# Altium schematic sheet UTHP BeagleBone Headers.SchDoc: Ultimate Truck Hacking Platform
size Letter; Author: Dr. Jeremy Daily; Organization: Systems Cyber Research Group; Address2: Thomas Balzer; Address3: Carson Green; DocumentNumber: Beagle Bone Black Headers; Revision: 1; SheetNumber: 1; SheetTotal: 6; ENG_APP_DATE: --/--/--; DSN_APP_DATE: --/--/--; CHK_APP_DATE: --/--/--
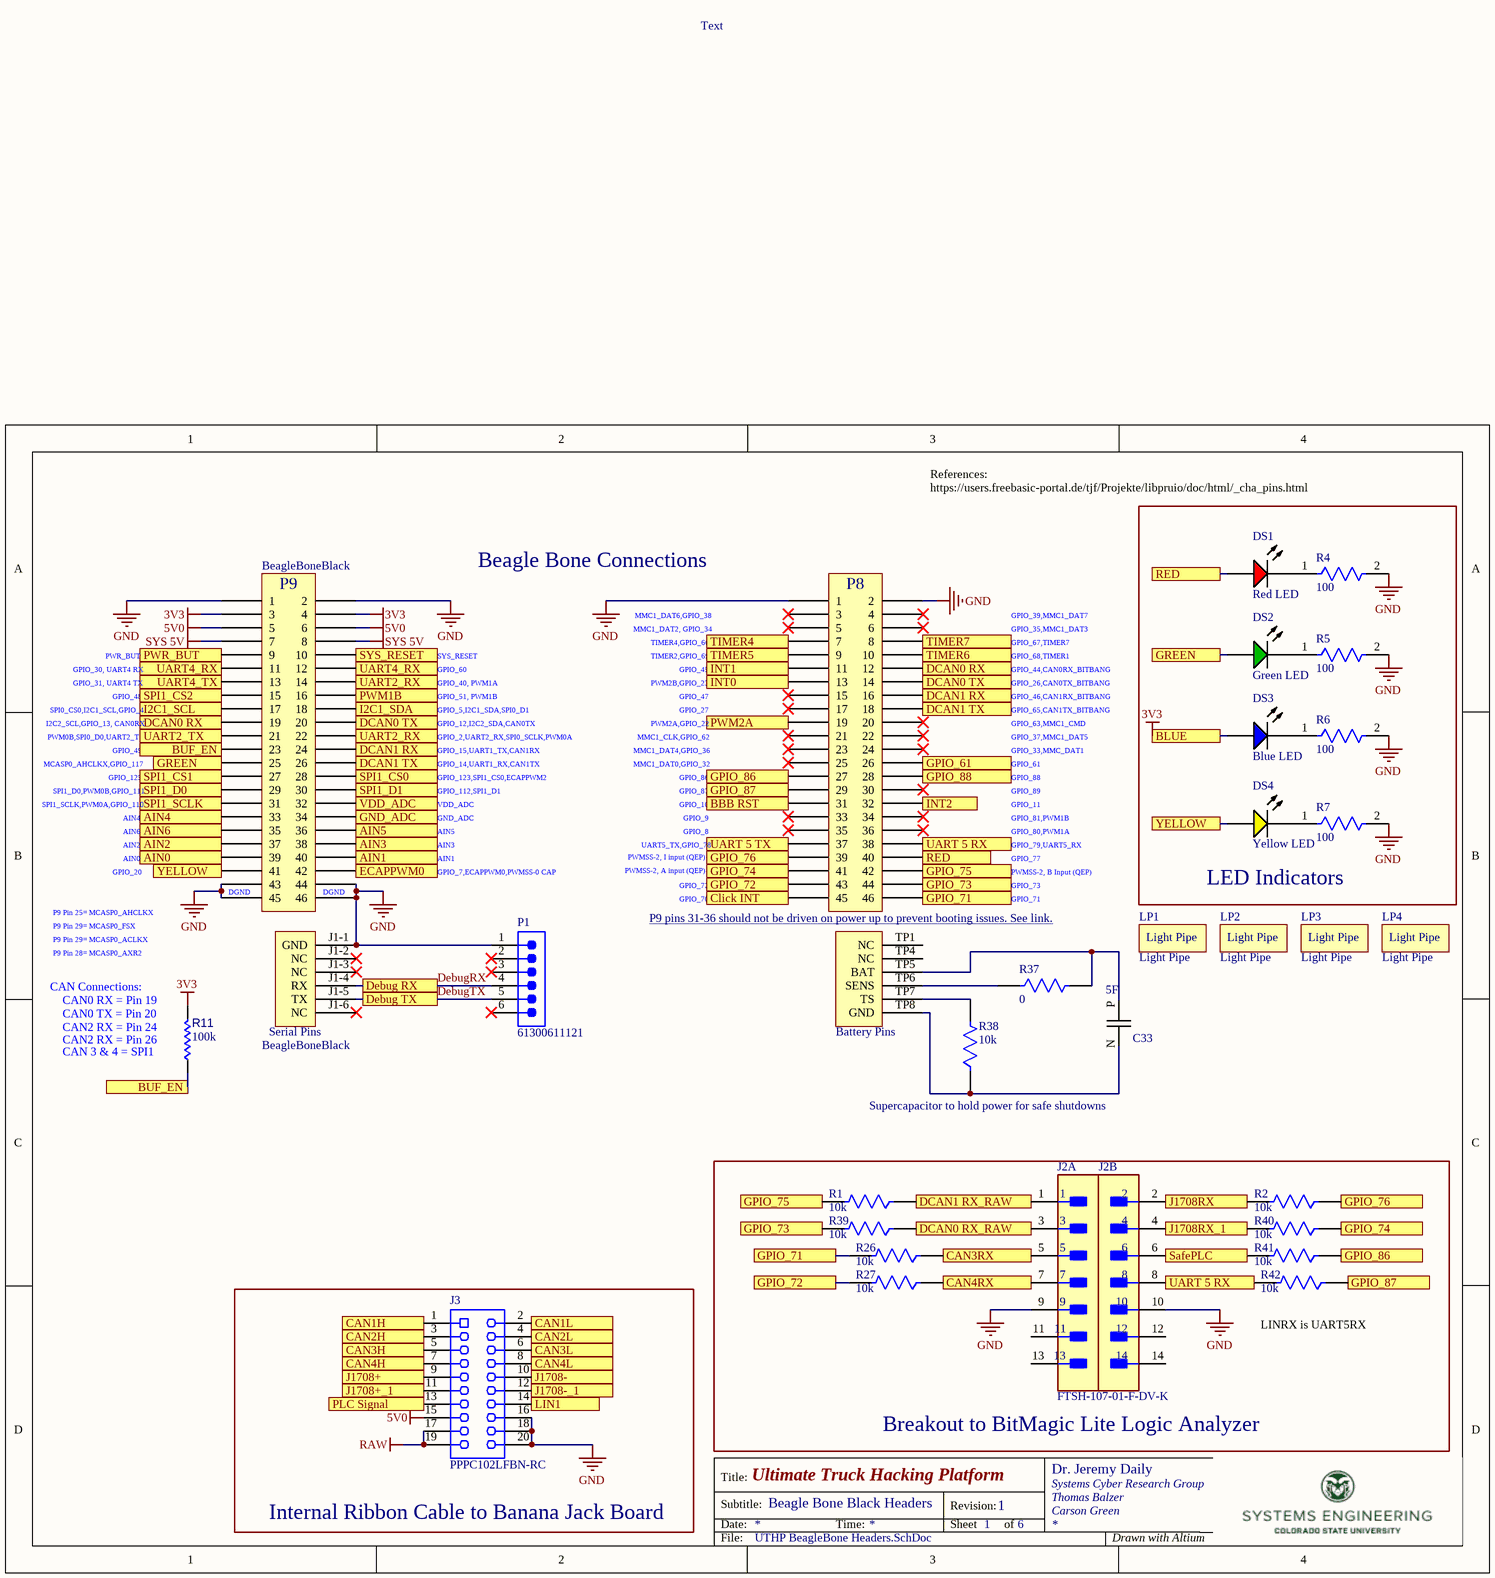
[diagram p0: UTHP BeagleBone Headers.SchDoc]

## Parts
BeagleBoneBlack  BeagleBoneBlack  [Beagleboneblack]
C33  5F  [New footprint 1]
DS1  Red LED  [LTST-C191KRKT_V]
DS2  Green LED  [LTST-C190GKT_V]
DS3  Blue LED  [LTST-C190TBKT-2_V]
DS4  Yellow LED  [LTST-C190KSKT_V]
J2  FTSH-107-01-F-DV-K  [FP-FTSH-107-01-F-DV-K-MFG]  (parts A,B of 2)
J3  PPPC102LFBN-RC  [SLIN-PPPC102LFBN-RC_V]
LP1  Light Pipe  [Lightpipe - SLP3]
LP2  Light Pipe  [Lightpipe - SLP3]
LP3  Light Pipe  [Lightpipe - SLP3]
LP4  Light Pipe  [Lightpipe - SLP3]
P1  61300611121  [61300611121]
R1  10k  [FP-KTR03-IPC_B]
R2  10k  [FP-KTR03-IPC_B]
R4  100  [FP-CRGCQ0603-IPC_C]
R5  100  [FP-CRGCQ0603-IPC_C]
R6  100  [FP-CRGCQ0603-IPC_C]
R7  100  [FP-CRGCQ0603-IPC_C]
R11  value 100k  [RESC1608X55X25ML10T15]  (hidden comment: Resistor 100k +/-1% 0603 100 mW)
R26  10k  [FP-KTR03-IPC_B]
R27  10k  [FP-KTR03-IPC_B]
R37  0  [FP-RMCF0805-MFG]
R38  10k  [FP-KTR03-IPC_B]
R39  10k  [FP-KTR03-IPC_B]
R40  10k  [FP-KTR03-IPC_B]
R41  10k  [FP-KTR03-IPC_B]
R42  10k  [FP-KTR03-IPC_B]

## Blocks framed on the sheet
LED Indicators: DS1-DS4 R4-R7
Breakout to BitMagic Lite Logic Analyzer: J2 R1 R2 R26 R27 R39-R42
Internal Ribbon Cable to Banana Jack Board: J3

## Ports
AIN0, AIN1, AIN2, AIN3, AIN4, AIN5, AIN6, BBB RST, BLUE, BUF_EN, CAN1H, CAN1L, CAN2H, CAN2L, CAN3H, CAN3L, CAN3RX, CAN4H, CAN4L, CAN4RX, Click INT, DCAN0 RX, DCAN0 RX_RAW, DCAN0 TX, DCAN1 RX, DCAN1 RX_RAW, DCAN1 TX, Debug RX, Debug TX, ECAPPWM0, GND_ADC, GPIO_61, GPIO_71, GPIO_72, GPIO_73, GPIO_74, GPIO_75, GPIO_76, GPIO_86, GPIO_87, GPIO_88, GREEN, I2C1_SCL, I2C1_SDA, INT0, INT1, INT2, J1708+, J1708+_1, J1708-, J1708-_1, J1708RX, J1708RX_1, LIN1, PLC Signal, PWM1B, PWM2A, PWR_BUT, RED, SafePLC, SPI1_CS0, SPI1_CS1, SPI1_CS2, SPI1_D0, SPI1_D1, SPI1_SCLK, SYS_RESET, TIMER4, TIMER5, TIMER6, TIMER7, UART2_RX, UART2_TX, UART4_RX, UART4_TX, UART 5 RX, UART 5 TX, VDD_ADC, YELLOW

## Nets
3V3: BeagleBoneBlack.3 BeagleBoneBlack.4 DS3.1(A) R11.2 ; port BLUE
5V0: BeagleBoneBlack.5 BeagleBoneBlack.6 J3.15
GND: BeagleBoneBlack.1 BeagleBoneBlack.2 BeagleBoneBlack.43 BeagleBoneBlack.44 BeagleBoneBlack.45 BeagleBoneBlack.46 BeagleBoneBlack.J1-1(GND) BeagleBoneBlack.P1(1) BeagleBoneBlack.P2(2) J2.9 J2.10 J3.16 J3.18 J3.20 P1.1 R4.2 R5.2 R6.2 R7.2
RAW: J3.17 J3.19
SYS 5V: BeagleBoneBlack.7 BeagleBoneBlack.8
AIN0: BeagleBoneBlack.39 ; port AIN0
AIN1: BeagleBoneBlack.40 ; port AIN1
AIN2: BeagleBoneBlack.37 ; port AIN2
AIN3: BeagleBoneBlack.38 ; port AIN3
AIN4: BeagleBoneBlack.33 ; port AIN4
AIN5: BeagleBoneBlack.36 ; port AIN5
AIN6: BeagleBoneBlack.35 ; port AIN6
BBB RST: BeagleBoneBlack.P31(31) ; port BBB RST
BUF_EN: BeagleBoneBlack.23 R11.1 ; port BUF_EN
CAN1H: J3.1 ; port CAN1H
CAN1L: J3.2 ; port CAN1L
CAN2H: J3.3 ; port CAN2H
CAN2L: J3.4 ; port CAN2L
CAN3H: J3.5 ; port CAN3H
CAN3L: J3.6 ; port CAN3L
CAN3RX: J2.5 R26.1 ; port CAN3RX
CAN4H: J3.7 ; port CAN4H
CAN4L: J3.8 ; port CAN4L
CAN4RX: J2.7 R27.1 ; port CAN4RX
Click INT: BeagleBoneBlack.P45(45) ; port Click INT
DCAN0 RX: BeagleBoneBlack.19 BeagleBoneBlack.P12(12) ; port DCAN0 RX
DCAN0 RX_RAW: J2.3 R39.1 ; port DCAN0 RX_RAW
DCAN0 TX: BeagleBoneBlack.20 BeagleBoneBlack.P14(14) ; port DCAN0 TX
DCAN1 RX: BeagleBoneBlack.24 BeagleBoneBlack.P16(16) ; port DCAN1 RX
DCAN1 RX_RAW: J2.1 R1.1 ; port DCAN1 RX_RAW
DCAN1 TX: BeagleBoneBlack.26 BeagleBoneBlack.P18(18) ; port DCAN1 TX
DebugRX: BeagleBoneBlack.J1-4(RX) P1.4 ; port Debug RX
DebugTX: BeagleBoneBlack.J1-5(TX) P1.5 ; port Debug TX
ECAPPWM0: BeagleBoneBlack.42 ; port ECAPPWM0
GND_ADC: BeagleBoneBlack.34 ; port GND_ADC
GPIO_61: BeagleBoneBlack.P26(26) ; port GPIO_61
GPIO_71: BeagleBoneBlack.P46(46) R26.2 ; port GPIO_71
GPIO_72: BeagleBoneBlack.P43(43) R27.2 ; port GPIO_72
GPIO_73: BeagleBoneBlack.P44(44) R39.2 ; port GPIO_73
GPIO_74: BeagleBoneBlack.P41(41) R40.1 ; port GPIO_74
GPIO_75: BeagleBoneBlack.P42(42) R1.2 ; port GPIO_75
GPIO_76: BeagleBoneBlack.P39(39) R2.1 ; port GPIO_76
GPIO_86: BeagleBoneBlack.P27(27) R41.1 ; port GPIO_86
GPIO_87: BeagleBoneBlack.P29(29) R42.1 ; port GPIO_87
GPIO_88: BeagleBoneBlack.P28(28) ; port GPIO_88
GREEN: BeagleBoneBlack.25 DS2.1(A) ; port GREEN
I2C1_SCL: BeagleBoneBlack.17 ; port I2C1_SCL
I2C1_SDA: BeagleBoneBlack.18 ; port I2C1_SDA
INT0: BeagleBoneBlack.P13(13) ; port INT0
INT1: BeagleBoneBlack.P11(11) ; port INT1
INT2: BeagleBoneBlack.P32(32) ; port INT2
J1708+: J3.9 ; port J1708+
J1708+_1: J3.11 ; port J1708+_1
J1708-: J3.10 ; port J1708-
J1708-_1: J3.12 ; port J1708-_1
J1708RX: J2.2 R2.2 ; port J1708RX
J1708RX_1: J2.4 R40.2 ; port J1708RX_1
LIN1: J3.14 ; port LIN1
PLC Signal: J3.13 ; port PLC Signal
PWM1B: BeagleBoneBlack.16 ; port PWM1B
PWM2A: BeagleBoneBlack.P19(19) ; port PWM2A
PWR_BUT: BeagleBoneBlack.9 ; port PWR_BUT
RED: BeagleBoneBlack.P40(40) DS1.1(A) ; port RED
SafePLC: J2.6 R41.2 ; port SafePLC
SPI1_CS0: BeagleBoneBlack.28 ; port SPI1_CS0
SPI1_CS1: BeagleBoneBlack.27 ; port SPI1_CS1
SPI1_CS2: BeagleBoneBlack.15 ; port SPI1_CS2
SPI1_D0: BeagleBoneBlack.29 ; port SPI1_D0
SPI1_D1: BeagleBoneBlack.30 ; port SPI1_D1
SPI1_SCLK: BeagleBoneBlack.31 ; port SPI1_SCLK
SYS_RESET: BeagleBoneBlack.10 ; port SYS_RESET
TIMER4: BeagleBoneBlack.P7(7) ; port TIMER4
TIMER5: BeagleBoneBlack.P9(9) ; port TIMER5
TIMER6: BeagleBoneBlack.P10(10) ; port TIMER6
TIMER7: BeagleBoneBlack.P8(8) ; port TIMER7
UART2_RX: BeagleBoneBlack.14 BeagleBoneBlack.22 ; port UART2_RX
UART2_TX: BeagleBoneBlack.21 ; port UART2_TX
UART4_RX: BeagleBoneBlack.11 BeagleBoneBlack.12 ; port UART4_RX
UART4_TX: BeagleBoneBlack.13 ; port UART4_TX
UART 5 RX: BeagleBoneBlack.P38(38) J2.8 R42.2 ; port UART 5 RX
UART 5 TX: BeagleBoneBlack.P37(37) ; port UART 5 TX
VDD_ADC: BeagleBoneBlack.32 ; port VDD_ADC
YELLOW: BeagleBoneBlack.41 DS4.1(A) ; port YELLOW
NetBeagleBoneBlack_TP5: BeagleBoneBlack.TP5(BAT) C33.P R37.2
NetBeagleBoneBlack_TP6: BeagleBoneBlack.TP6(SENS) R37.1
NetBeagleBoneBlack_TP7: BeagleBoneBlack.TP7(TS) R38.2
NetBeagleBoneBlack_TP8: BeagleBoneBlack.TP8(GND) C33.N R38.1
NetDS1_2: DS1.2(K) R4.1
NetDS2_2: DS2.2(K) R5.1
NetDS3_2: DS3.2(K) R6.1
NetDS4_2: DS4.2(K) R7.1

Not connected (* = marked no-connect by the designer): BeagleBoneBlack J1-2(NC)* J1-3(NC)* J1-6(NC)* P3(3)* P4(4)* P5(5)* P6(6)* P15(15)* P17(17)* P20(20)* P21(21)* P22(22)* P23(23)* P24(24)* P25(25)* P30(30)* P33(33)* P34(34)* P35(35)* P36(36)* TP1(NC) TP4(NC); J2 11 12 13 14; P1 2* 3* 6*

## Notes on the sheet
- Text
- References:
  https://users.freebasic-portal.de/tjf/Projekte/libpruio/doc/html/_cha_pins.html
- (near BeagleBoneBlack) Beagle Bone Connections
- PWR_BUT
- (near BeagleBoneBlack) SYS_RESET
- (near BeagleBoneBlack) MMC1_DAT2, GPIO_34
- (near BeagleBoneBlack) MMC1_DAT6,GPIO_38
- (near BeagleBoneBlack) TIMER4,GPIO_66
- (near BeagleBoneBlack) TIMER2,GPIO_69
- GPIO_39,MMC1_DAT7
- GPIO_35,MMC1_DAT3
- GPIO_67,TIMER7
- GPIO_68,TIMER1
- SPI0_CS0,I2C1_SCL,GPIO_4
- GPIO_30, UART4 RX
- GPIO_31, UART4 TX
- GPIO_48
- (near BeagleBoneBlack) GPIO_60
- (near BeagleBoneBlack) GPIO_40, PWM1A
- (near BeagleBoneBlack) GPIO_51, PWM1B
- (near BeagleBoneBlack) GPIO_5,I2C1_SDA,SPI0_D1
- (near BeagleBoneBlack) PWM2B,GPIO_23
- (near BeagleBoneBlack) GPIO_45
- (near BeagleBoneBlack) GPIO_47
- (near BeagleBoneBlack) GPIO_27
- GPIO_44,CAN0RX_BITBANG
- GPIO_26,CAN0TX_BITBANG
- GPIO_46,CAN1RX_BITBANG
- GPIO_65,CAN1TX_BITBANG
- MCASP0_AHCLKX,GPIO_117
- I2C2_SCL,GPIO_13, CAN0RX
- PWM0B,SPI0_D0,UART2_TX
- SPI1_D0,PWM0B,GPIO_111
- GPIO_125
- GPIO_49
- (near BeagleBoneBlack) GPIO_12,I2C2_SDA,CAN0TX
- (near BeagleBoneBlack) GPIO_2,UART2_RX,SPI0_SCLK,PWM0A
- (near BeagleBoneBlack) GPIO_15,UART1_TX,CAN1RX
- (near BeagleBoneBlack) GPIO_14,UART1_RX,CAN1TX
- (near BeagleBoneBlack) GPIO_123,SPI1_CS0,ECAPPWM2
- (near BeagleBoneBlack) GPIO_112,SPI1_D1
- (near BeagleBoneBlack) MMC1_DAT4,GPIO_36
- (near BeagleBoneBlack) MMC1_DAT0,GPIO_32
- (near BeagleBoneBlack) MMC1_CLK,GPIO_62
- (near BeagleBoneBlack) PWM2A,GPIO_22
- (near BeagleBoneBlack) GPIO_86
- (near BeagleBoneBlack) GPIO_87
- GPIO_63,MMC1_CMD
- GPIO_37,MMC1_DAT5
- GPIO_33,MMC_DAT1
- GPIO_61
- GPIO_88
- GPIO_89
- SPI1_SCLK,PWM0A,GPIO_110
- AIN4
- AIN6
- AIN2
- (near BeagleBoneBlack) VDD_ADC
- (near BeagleBoneBlack) GND_ADC
- (near BeagleBoneBlack) AIN5
- (near BeagleBoneBlack) AIN3
- (near BeagleBoneBlack) UART5_TX,GPIO_78
- (near BeagleBoneBlack) GPIO_10
- (near BeagleBoneBlack) GPIO_9
- (near BeagleBoneBlack) GPIO_8
- (near BeagleBoneBlack) PWMSS-2, I input (QEP)
- GPIO_11
- GPIO_81,PWM1B
- GPIO_80,PWM1A
- GPIO_79,UART5_RX
- P9 Pin 25= MCASP0_AHCLKX
- P9 Pin 29= MCASP0_FSX
- GPIO_20
- AIN0
- (near BeagleBoneBlack) DGND
- (near BeagleBoneBlack) AIN1
- (near BeagleBoneBlack) GPIO_7,ECAPPWM0,PWMSS-0 CAP
- (near BeagleBoneBlack) P9 pins 31-36 should not be driven on power up to prevent booting issues. See link. <https://docs.beagleboard.org/latest/boards/beaglebone/black/ch08.html#boot-pin>
- (near BeagleBoneBlack) GPIO_72
- (near BeagleBoneBlack) GPIO_70
- (near BeagleBoneBlack) PWMSS-2, A input (QEP)
- GPIO_77
- PWMSS-2, B Input (QEP)
- GPIO_73
- GPIO_71
- (near R11) CAN Connections:
- P9 Pin 29= MCASP0_ACLKX
- P9 Pin 28= MCASP0_AXR2
- (near R11) CAN0 TX = Pin 20
- (near R11) CAN0 RX = Pin 19
- (near R11) CAN2 RX = Pin 24
- (near R11) CAN2 RX = Pin 26
- (near R11) CAN 3 & 4 = SPI1
- (near R38) Supercapacitor to hold power for safe shutdowns
- Type @ to refer to a designator or a net
- (near R42) LINRX is UART5RX
- Title:
- Subtitle:
- Date:
- Time:
- Revision:
- Sheet
- of
- File:
- Drawn with Altium
- (in symbol CMP-061-000000-1) Serial Pins; Battery Pins

## Library data of the parts
BeagleBoneBlack = CMP-061-000000-1: Revision C with all headers and test points; Manufacturer: BeagleBoard by Seeed Studio; Part Number: 102110420; Value: BeagleBone Black Revision C; Supplier 1: Digi-Key; Supplier Part Number 1: 2820-102110420-ND
C33 = CMP-001-00088-1: DSF505Q6R0JBG; Manufacturer: Panasonic Electronic Components; Part Number: ERJ-3EKF4701V; Value: 4.7k; Supplier 1: Digi-Key; Supplier Part Number 1: P4.70KHCT-ND
DS1 = CMP-007-00024-2: LED Uni-Color Red, 62.5 mW, 25 mA, -30 to 85 degC, 2-Pin SMD, RoHS, Tape and Reel; Manufacturer: Lite-On
DS2 = CMP-007-00022-2: LED Uni-Color Green, 100 mW, 30 mA, -55 to 85 degC, 2-Pin SMD, RoHS, Tape and Reel; Manufacturer: Lite-On
DS3 = CMP-007-00026-2: LED Uni-Color Blue, 76 mW, 20 mA, -20 to 80 degC, 2-Pin SMD, RoHS, Tape and Reel; Manufacturer: Lite-On
DS4 = CMP-007-00025-2: LED Uni-Color Yellow, 75 mW, 30 mA, -30 to 85 degC, 2-Pin SMD, RoHS, Tape and Reel; Manufacturer: Lite-On
J2 = CMP-02766-001448-1: CONN HEADER SMD 14POS 1.27MM; Gender: Male; Connector Type: Male Pin; Number of Contacts: 14; Row Spacing: 0.05inch; Min Operating Temperature: -55°C; Package Quantity: 1; Lead Free: Lead Free; RoHS Compliant: Yes; Contact Material: Bronze; Contact Plating: Gold; Number of Rows: 2; Housing Material: Polymer; Contact Type: Male Pin; Series: FTSH; Max Operating Temperature: 125°C; Orientation: Straight; Number of Positions: 14; Pitch: 1.27mm; Housing Color: Black; Color: Black; Radiation Hardening: No; Length: 8.89mm; Termination: Solder; Packaging: Rail/Tube; Depth: 5.84mm; Mount: Surface Mount; Contact Mating Length: 0.12inch
J3 = CMP-002-00029-2: Female Header, Pitch 2.54 mm, 2 x 10 Position, Height 8.75 mm, Tail Length 3.2 mm, -40 to 105 degC, RoHS, Bulk; Manufacturer: Sullins
LP1-LP4 = CMP-023-000058-1: Design Item ID: Light Pipe; Source: SSS Schematic Library.SchLib; Pin Count: 0; Component Type: Standard
  LP1: Parameter 1: *
P1 = CMP-1502-01070-2: Termination: Through Hole
R1 R2 R26 R27 R38-R42 = CMP-08839-030382-1: 10 kOhms ±1% 0.1W, 1/10W Chip Resistor 0603 (1608 Metric) Automotive AEC-Q200, High Voltage Thick Film; Manufacturer: Rohm Semiconductor; Part Number: KTR03EZPF1002; Supplier 1: Digi-Key; Supplier Part Number 1: RHM10.0KAYCT-ND; Value: 10k
R4-R7 = CMP-03211-002191-1: CRGCQ0603 100Ω 1% ±200ppm/°C 75V; Manufacturer Part Number: CRGCQ0603F100R; Manufacturer: TE Connectivity; Value: 100Ω
R11 = CMP-009-00023-7: Chip Resistor, 100 KOhm, +/- 1%, 0.1 W, -55 to 155 degC, 0603 (1608 Metric); Voltage Rating: 50V; Power: 100mW; Max Operating Temperature: 155°C; Pins: 2; Mounting Technology: SM; Min Operating Temperature: -55°C; Case/Package: 0603; Tolerance: 1%; RoHS Compliant: True
R37 = CMP-26527-000017-1: RES 0 OHM JUMPER 1/8W 0805; Manufacturer: Stackpole Electronics Inc; Part Number: RMCF0805ZT0R00; Supplier 1: Digi-Key; Supplier Part Number 1: RMCF0805ZT0R00CT-ND; Value: 0